# Altium schematic sheet Buttons.SchDoc
size A4
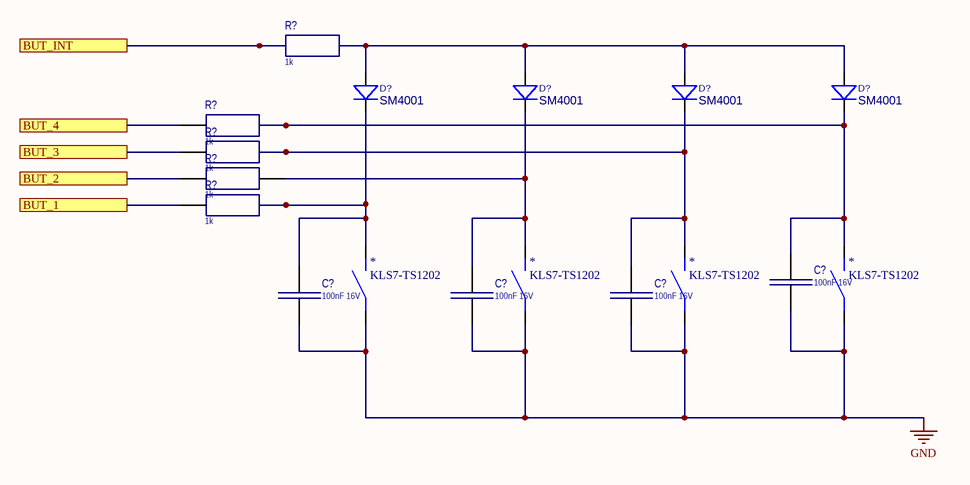
[diagram p0: Buttons.SchDoc]

## Parts
(Parts that share a designator on the sheet are numbered #1, #2 ... from top to bottom, then left to right.)
*#1  KLS7-TS1202  [KLS7-TS1202]
*#2  KLS7-TS1202  [KLS7-TS1202]
*#3  KLS7-TS1202  [KLS7-TS1202]
*#4  KLS7-TS1202  [KLS7-TS1202]
C?#1  100nF 16V  [C_0603]
C?#2  100nF 16V  [C_0603]
C?#3  100nF 16V  [C_0603]
C?#4  100nF 16V  [C_0603]
D?#1  SM4001  [DIODE_DO-213AB]
D?#2  SM4001  [DIODE_DO-213AB]
D?#3  SM4001  [DIODE_DO-213AB]
D?#4  SM4001  [DIODE_DO-213AB]
R?#1  1k  [R_0805]
R?#2  1k  [R_0805]
R?#3  1k  [R_0805]
R?#4  1k  [R_0805]
R?#5  1k  [R_0805]

## Ports
BUT_1, BUT_2, BUT_3, BUT_4, BUT_INT

## Nets
GND: *#1.1 *#2.1 *#3.1 *#4.1 C?#1.1 C?#2.1 C?#3.1 C?#4.1
BUT_1: R?#5.1 ; port BUT_1
BUT_2: R?#4.1 ; port BUT_2
BUT_3: R?#3.1 ; port BUT_3
BUT_4: R?#2.1 ; port BUT_4
BUT_INT: R?#1.1 ; port BUT_INT
Net*#1_2: *#1.2 C?#2.2 D?#1.2(K) R?#5.2
Net*#2_2: *#2.2 C?#3.2 D?#2.2(K) R?#4.2
Net*#3_2: *#3.2 C?#4.2 D?#3.2(K) R?#3.2
Net*#4_2: *#4.2 C?#1.2 D?#4.2(K) R?#2.2
NetD?#1_1: D?#1.1(A) D?#2.1(A) D?#3.1(A) D?#4.1(A) R?#1.2

## Library data of the parts
*#1-*#4 = KLS7-TS1202: Button
C?#1-C?#4 = C0603: Capacitor; Value: 100nF 16V
D?#1-D?#4 = D_DO-213: Diode
R?#1-R?#5 = R0805: Resistor; Value: 1k